# Altium schematic sheet LEDBlock.SchDoc
size A4; SheetNumber: 4; SheetTotal: 5
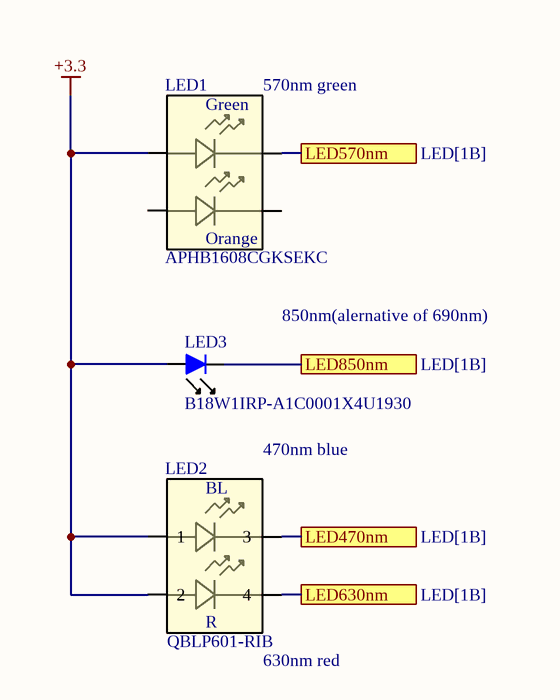
[diagram p0: LEDBlock.SchDoc]

## Parts
LED1  APHB1608CGKSEKC  [APHB1608CGKSEKC_KNB]
LED2  QBLP601-RIB  [DFN65P160X55-4N]
LED3  B18W1IRP-A1C0001X4U1930  [CAPCP1608X10N]

## Ports
LED470nm (see LED[1B]), LED570nm (see LED[1B]), LED630nm (see LED[1B]), LED850nm (see LED[1B])

## Nets
+3.3: LED1.1 LED2.1 LED2.2 LED3.2(A)
LED470nm: LED2.3 ; port LED470nm
LED570nm: LED1.2 ; port LED570nm
LED630nm: LED2.4 ; port LED630nm
LED850nm: LED3.1(K) ; port LED850nm

Not connected (* = marked no-connect by the designer): LED1 3 4

## Notes on the sheet
- (near LED1) 570nm green
- 850nm(alernative of 690nm)
- 470nm blue
- (near LED2) 630nm red
- (in symbol CMP-007-00006-3) Green; Orange
- (in symbol CMP-007-00009-2) BL; R

## Library data of the parts
LED1 = CMP-007-00006-3: Dual Color LED, Super Bright Orange/green, Water Clear, 1.6mm; Mfr_Name: Kingbright; RoHS Compliant: Yes; Source: APHB1608CGKSEKC.SchLib; Design Item ID: APHB1608CGKSEKC
LED2 = CMP-007-00009-2: Blue, Red 470nm Blue, 630nm Red LED Indication - Discrete 3.1V Blue, 2V Red 0603 (1608 Metric)
LED3 = CMP-007-00008-2: Infrared (IR) Emitter 850nm 1.7V 100mA 23mW/sr @ 100mA (Typ) 80° 0603 (1608 Metric)